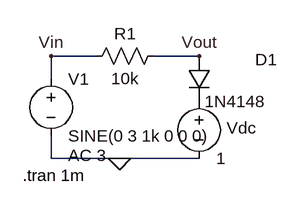
[diagram p0: schematic 9e.asc]
9e.asc, the LTspice schematic file:
Version 4
SHEET 1 880 680
WIRE 128 64 64 64
WIRE 272 64 208 64
WIRE 64 96 64 64
WIRE 64 208 64 176
WIRE 160 208 64 208
WIRE 272 208 160 208
FLAG 160 208 0
FLAG 272 64 Vout
FLAG 64 64 Vin
SYMBOL voltage 64 80 R0
WINDOW 123 24 124 Left 2
WINDOW 39 0 0 Left 0
SYMATTR Value2 AC 3
SYMATTR InstName V1
SYMATTR Value SINE(0 3 1k 0 0 0)
SYMBOL voltage 272 112 R0
WINDOW 123 0 0 Left 0
WINDOW 39 0 0 Left 0
WINDOW 0 39 53 Left 2
SYMATTR InstName Vdc
SYMATTR Value 1
SYMBOL res 224 48 R90
WINDOW 0 0 56 VBottom 2
WINDOW 3 32 56 VTop 2
SYMATTR InstName R1
SYMATTR Value 10k
SYMBOL diode 256 64 R0
WINDOW 0 95 5 Left 2
SYMATTR InstName D1
SYMATTR Value 1N4148
TEXT 24 232 Left 2 !.tran 1m

The netlist it stands for:
* 9e.asc
V1 Vin 0 SINE(0 3 1k 0 0 0) AC 3
Vdc P001 0 1
R1 Vout Vin 10k
D1 Vout P001 1N4148
.model D D
.lib standard.dio
.tran 1m
.backanno
.end